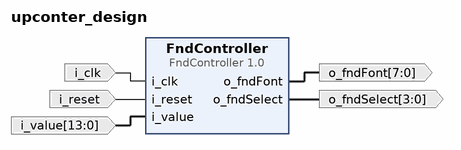
[diagram p0: block diagram of the top level]
# Vivado block design upconter_design, xc7a35tcpg236-1, Vivado 2020.1
create_bd_design upconter_design

create_bd_port -dir O -from 3 -to 0 o_fndSelect
create_bd_port -dir O -from 7 -to 0 o_fndFont
create_bd_port -dir I -type clk i_clk
set_property -dict {CONFIG.ASSOCIATED_RESET i_reset} [get_bd_ports i_clk]
create_bd_port -dir I -type rst i_reset
create_bd_port -dir I -from 13 -to 0 i_value

create_bd_cell -type ip -vlnv xilinx.com:user:FndController:1.0 FndController

# ---- connections ----

connect_bd_net -net FndController_0_o_fndSelect [get_bd_pins FndController/o_fndSelect] [get_bd_ports o_fndSelect]
connect_bd_net -net FndController_0_o_fndFont [get_bd_pins FndController/o_fndFont] [get_bd_ports o_fndFont]
connect_bd_net -net i_clk_0_1 [get_bd_ports i_clk] [get_bd_pins FndController/i_clk]
connect_bd_net -net i_reset_0_1 [get_bd_ports i_reset] [get_bd_pins FndController/i_reset]
connect_bd_net -net i_value_0_1 [get_bd_ports i_value] [get_bd_pins FndController/i_value]

validate_bd_design
save_bd_design
